# Altium schematic sheet POWER.SchDoc
size A4
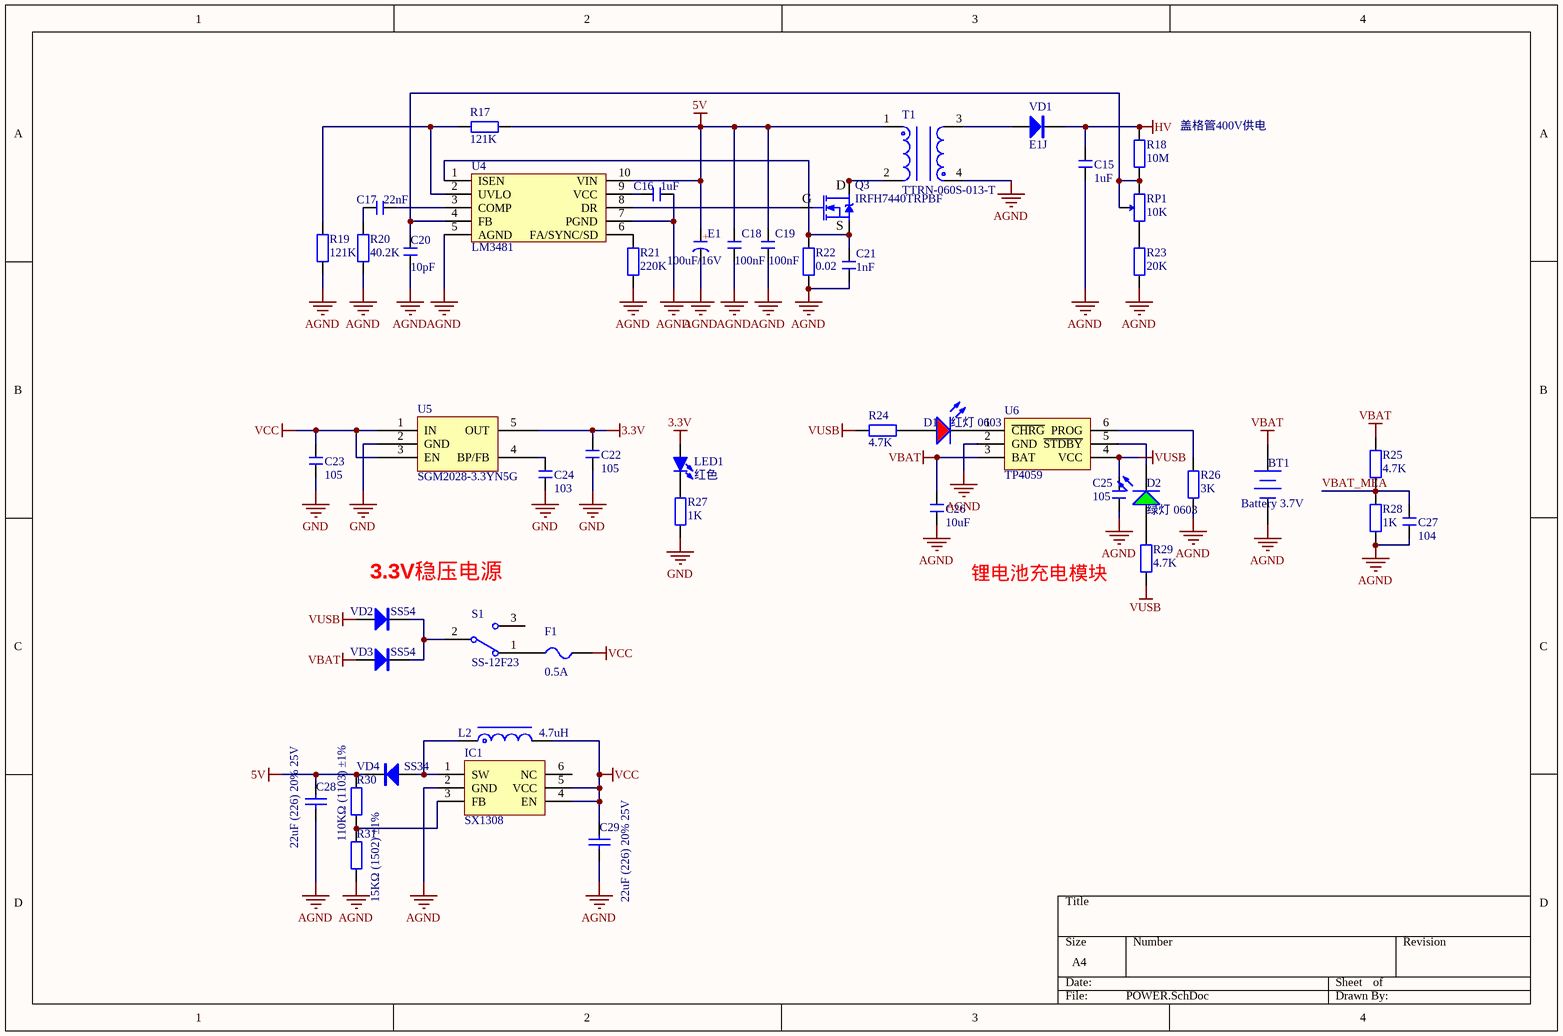
[diagram p0: POWER.SchDoc]

## Parts
BT1  Battery 3.7V  [BAT-2]
C15  1uF  [C 1812]
C16  1uF  [C 0603]
C17  22nF  [C 0603]
C18  100nF  [C 0603]
C19  100nF  [C 0603]
C20  10pF  [C 0603]
C21  1nF  [C 0603]
C22  105  [C 0603]
C23  105  [C 0603]
C24  103  [C 0603]
C25  105  [C 0603]
C26  10uF  [C 0805]
C27  104  [C 0603]
C28  22uF (226) 20% 25V  [0805_C]
C29  22uF (226) 20% 25V  [0805_C]
D1  红灯 0603  [0603_LED_S1]
D2  绿灯 0603  [0603_LED_S1]
E1  100uF/16V  [CM D(6.3*5.4)]
F1  0.5A  [FU 0805]
IC1  SX1308  [SOT23-6N]
L2  4.7uH  [L 04020]
LED1  红色  [LED 0603W]
Q3  IRFH7440TRPBF  [PQFN8_5X6_B_INF]
R17  121K  [R 0603]
R18  10M  [R 0603]
R19  121K  [R 0603]
R20  40.2K  [R 0603]
R21  220K  [R 0603]
R22  0.02  [R 0805]
R23  20K  [R 0603]
R24  4.7K  [R 0603]
R25  4.7K  [R 0603]
R26  3K  [R 0603]
R27  1K  [R 0603]
R28  1K  [R 0603]
R29  4.7K  [R 0603]
R30  110KΩ (1103) ±1%  [0603_R]
R31  15KΩ (1502) ±1%  [0603_R]
RP1  10K  [3303W]
S1  SS-12F23  [SS-12D07]
T1  TTRN-060S-013-T  [EE5.0]
U4  LM3481  [VSSOP10]
U5  SGM2028-3.3YN5G  [SOT23-5]
U6  TP4059  [SOT23-6_N]
VD1  E1J  [SOD-123F]
VD2  SS54  [SMA]
VD3  SS54  [SMA]
VD4  SS34  [SMA]

## Nets
3.3V: C22.2 LED1.1(A) U5.5(OUT)
5V: C18.2 C19.2 C28.2 E1.1(A) R17.1 R30.2 T1.1 U4.10(VIN) VD4.2(K)
AGND: BT1.2(-) C15.1 C16.2 C18.1 C19.1 C20.1 C21.1 C25.1 C26.1 C27.1 C28.1 C29.1 E1.2(K) IC1.2(GND) R19.1 R20.1 R21.1 R22.1 R23.1 R26.2 R28.1 R31.1 T1.4 U4.5(AGND) U4.7(PGND) U6.2(GND)
GND: C22.1 C23.1 C24.2 R27.2 U5.2(GND)
HV: C15.2 R18.2 VD1.2(K)
VBAT: BT1.1(+) C26.2 R25.2 U6.3(BAT) VD3.1(A)
VCC: C23.2 C29.2 F1.2 IC1.4(EN) IC1.5(VCC) L2.2 U5.1(IN) U5.3(EN)
VUSB: C25.2 R24.2 R29.2 U6.4(VCC) VD2.1(A)
VBAT_MEA: C27.2 R25.1 R28.2
NetC16_1: C16.1 U4.9(VCC)
NetC17_1: C17.1 R20.2
NetC17_2: C17.2 U4.3(COMP)
NetC20_2: C20.2 R18.1 RP1.1 RP1.2 U4.4(FB)
NetC21_2: C21.2 Q3.1(S) Q3.2(S) Q3.3(S) R22.2 U4.1(ISEN)
NetC24_1: C24.1 U5.4(BP/FB)
NetD1_A: D1.A R24.1
NetD1_K: D1.K U6.1(~{CHRG})
NetD2_A: D2.A R29.1
NetD2_K: D2.K U6.5(~{STDBY})
NetF1_1: F1.1 S1.1
NetIC1_1: IC1.1(SW) L2.1 VD4.1(A)
NetIC1_3: IC1.3(FB) R30.1 R31.2
NetLED1_2: LED1.2(K) R27.1
NetQ3_4: Q3.4(G) U4.8(DR)
NetQ3_5: Q3.5(D) Q3.6(D) Q3.7(D) Q3.8(D) T1.2
NetR17_2: R17.2 R19.2 U4.2(UVLO)
NetR21_2: R21.2 U4.6(FA/SYNC/SD)
NetR23_2: R23.2 RP1.3
NetR26_1: R26.1 U6.6(PROG)
NetS1_2: S1.2 VD2.2(K) VD3.2(K)
NetT1_3: T1.3 VD1.1(A)

Not connected (* = marked no-connect by the designer): IC1 6(NC); S1 3

## Notes on the sheet
- (near R18) 盖格管400V供电
- 3.3V稳压电源
- 锂电池充电模块
- (in symbol C-CM) +

## Library data of the parts
BT1 = Battery: Multicell Battery; Published: 24-Mar-1999; LatestRevisionDate: 17-Jul-2002; LatestRevisionNote: Re-released for DXP Platform.; PackageReference: BAT-2; Publisher: Altium Limited; PackageDescription: Battery; 2 Leads
C15-C27 = C: 无极性贴片电容; 版权归属: 源创客; BOM名称: 无极性贴片电容; 学习资源: www.ooocke.com
C28 C29 = 0805 22uF (226) 20% 25V: 贴片电容; ComponentLink1Description: 供应商链接; ComponentLink1URL: http://www.szlcsc.com/product/details_46786.html; Package: 0805; Supplier: LC; SuppliersPartNumber: C45783
D1 = 0603 红灯: 发光二极管; ComponentLink1Description: 供应商链接; ComponentLink1URL: http://www.szlcsc.com/product/details_2659.html; Package: 0603; Supplier: LC; SuppliersPartNumber: C2286
D2 = 0603 绿灯: 发光二极管; ComponentLink1Description: 供应商链接; ComponentLink1URL: http://www.szlcsc.com/product/details_73152.html; Package: 0603; Supplier: LC; SuppliersPartNumber: C72043
E1 = C-CM: 贴片电解电容; 版权归属: 源创客; BOM名称: 贴片电解电容; 学习资源: www.ooocke.com
F1 = FU: 贴片保险丝; 版权归属: 源创客; BOM名称: 贴片保险丝; 学习资源: www.ooocke.com
IC1 = SX1308: 可调升压芯片; 封装库来自淘宝卖家 ID：黄晶宝石: 其他店铺购入均为假冒，请立即申请退款，本店奖励2~5元现金; BOM名称: 可调升压芯片
L2 = L-CDRH: 功率屏蔽电感; 版权归属: 源创客; BOM名称: 功率屏蔽电感; 学习资源: www.ooocke.com
LED1 = LED-SMD: 贴片LED; 版权归属: 源创客; BOM名称: 贴片LED; 学习资源: www.ooocke.com
Q3 = IRFH7440TRPBF: 40V/159A N沟道MOS管
R17-R29 = R: 贴片电阻; 版权归属: 源创客; BOM名称: 贴片电阻; 学习资源: www.ooocke.com
R30 = 0603 110KΩ (1103) 1%: 贴片电阻; ComponentLink1Description: 供应商链接; ComponentLink1URL: http://www.szlcsc.com/product/details_26548.html; Package: 0603; Supplier: LC; SuppliersPartNumber: C25805
R31 = 0603 15KΩ (1502) 1%: 贴片电阻; ComponentLink1Description: 供应商链接; ComponentLink1URL: http://www.szlcsc.com/product/details_23536.html; Package: 0603; Supplier: LC; SuppliersPartNumber: C22809
RP1 = RP-SMD: 贴片电位器; 版权归属: 源创客; BOM名称: 贴片电位器; 学习资源: www.ooocke.com
S1 = SSW-1P: 1路拨动开关; BOM名称: 波动开关; 版权归属: 源创客; 学习资源: www.ooocke.com
T1 = TTRN-060S-013-T: 1:10.5 3.2A 贴片闪光灯变压器
U4 = LM3481: High-Efficiency Controller for Boost, SEPIC and Flyback DC-DC Converters
U5 = SGM2028-3.3YN5G: 500mA,3.3V低压差线性稳压器
U6 = TP4059: 600mA单节锂电池充电芯片
VD1 = E1J: 600V/1A 超快恢复二极管
VD2-VD4 = SS14: 肖特基二极管; 版权归属: 源创客; 属性: 40V/1A; BOM名称: 肖特基二极管; 学习资源: www.ooocke.com